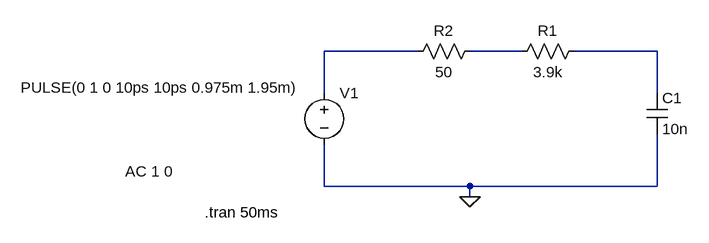
[diagram p0: schematic Draft2.asc]
Draft2.asc, the LTspice schematic file:
Version 4
SHEET 1 880 680
WIRE 96 48 -48 48
WIRE 256 48 176 48
WIRE 464 48 336 48
WIRE -48 112 -48 48
WIRE 464 112 464 48
WIRE -48 256 -48 192
WIRE 176 256 -48 256
WIRE 464 256 464 176
WIRE 464 256 176 256
WIRE 176 272 176 256
FLAG 176 272 0
SYMBOL cap 448 112 R0
SYMATTR InstName C1
SYMATTR Value 10n
SYMBOL res 352 32 R90
WINDOW 0 0 56 VBottom 2
WINDOW 3 32 56 VTop 2
SYMATTR InstName R1
SYMATTR Value 3.9k
SYMBOL voltage -48 96 R0
WINDOW 123 -306 137 Left 2
WINDOW 39 0 0 Left 2
WINDOW 3 -467 8 Left 2
SYMATTR Value2 AC 1 0
SYMATTR Value PULSE(0 1 0 10ps 10ps 0.975m 1.95m)
SYMATTR InstName V1
SYMBOL res 192 32 R90
WINDOW 0 0 56 VBottom 2
WINDOW 3 32 56 VTop 2
SYMATTR InstName R2
SYMATTR Value 50
TEXT -232 296 Left 2 !.tran 50ms

The netlist it stands for:
* Draft2.asc
C1 N003 0 10n
R1 N003 N002 3.9k
V1 N001 0 PULSE(0 1 0 10ps 10ps 0.975m 1.95m) AC 1 0
R2 N002 N001 50
.tran 50ms
.backanno
.end